# EAGLE design stk200 (EAGLE 6.2)
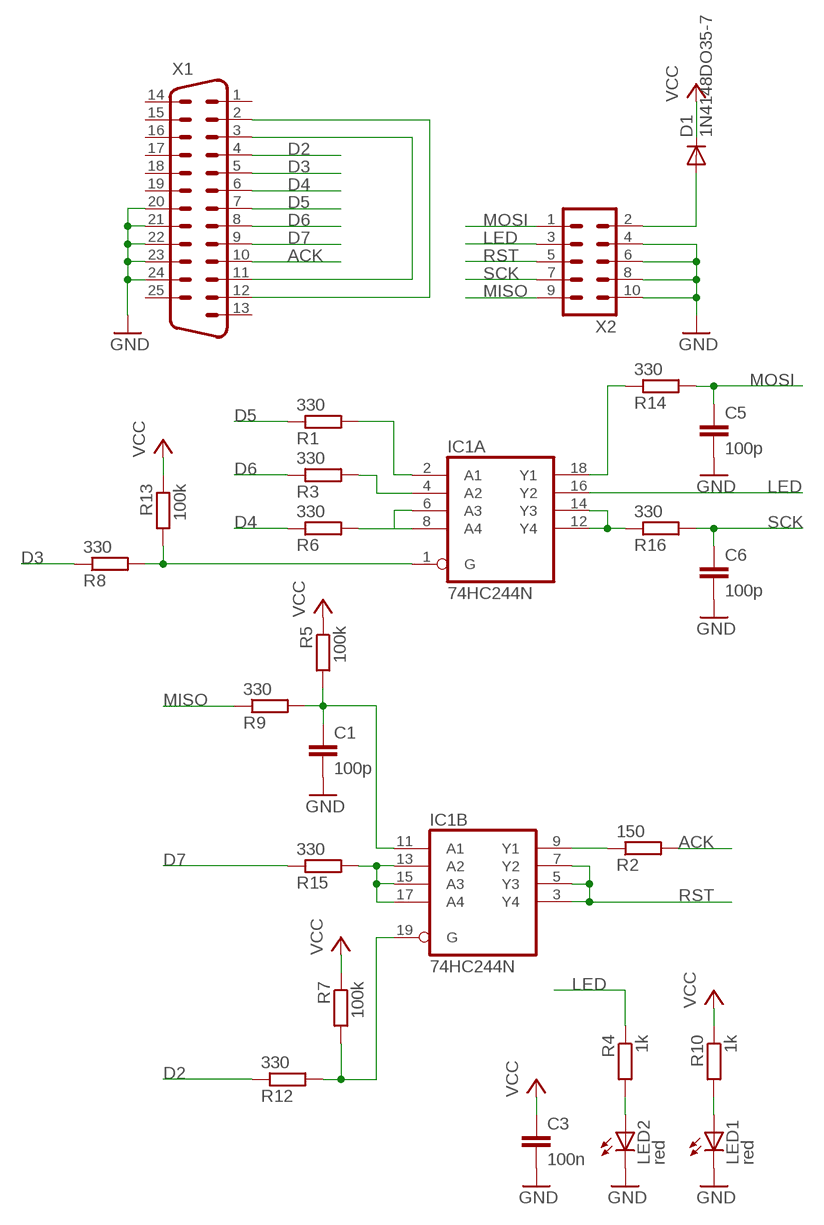
[diagram p0: schematic, sheet 1]

## Parts
C1  100p  C-EU025-024X044  [C025-024X044]
C3  100n  C-EU025-024X044  [C025-024X044]
C5  100p  C-EU102-043X133  [C102-043X133]
C6  100p  C-EU102-043X133  [C102-043X133]
D1  1N4148DO35-7  [DO35-7]
IC1  74HC244N  [DIL20]
LED1  red  LED3MM  [LED3MM]
LED2  red  LED3MM  [LED3MM]
R1  330  R-EU_0207/10  [0207/10]
R2  150  R-EU_0207/15  [0207/15]
R3  330  R-EU_0204/2V  [0204V]
R4  1k  R-EU_0207/15  [0207/15]
R5  100k  R-EU_0617/22  [0617/22]
R6  330  R-EU_0204/2V  [0204V]
R7  100k  R-EU_0204/2V  [0204V]
R8  330  R-EU_0617/17  [0617/17]
R9  330  R-EU_0204/5  [0204/5]
R10  1k  R-EU_0204/5  [0204/5]
R12  330  R-EU_0207/10  [0207/10]
R13  100k  R-EU_M1206  [M1206]
R14  330  R-EU_0204/2V  [0204V]
R15  330  R-EU_0207/12  [0207/12]
R16  330  R-EU_0204/5  [0204/5]
X1  M25D  [M25D]
X2  ML10L  [ML10L]

## Nets
ACK: R2.2 X1.10
D2: R12.1 X1.4
D3: R8.1 X1.5
D4: R6.1 X1.6
D5: R1.1 X1.7
D6: R3.1 X1.8
D7: R15.1 X1.9
GND: C1.2 C3.2 C5.2 C6.2 LED1.K(C) LED2.K(C) X1.20 X1.21 X1.22 X1.23 X1.24 X2.4 X2.6 X2.8 X2.10
LED: IC1.16(A:Y2) R4.1 X2.3
MISO: R9.1 X2.9
MOSI: C5.1 R14.2 X2.1
N$1: LED1.A R10.2
N$2: IC1.6(A:A3) IC1.8(A:A4) R6.2
N$3: D1.A X2.2
N$4: IC1.13(B:A2) IC1.15(B:A3) IC1.17(B:A4) R15.2
N$5: X1.2 X1.12
N$6: IC1.12(A:Y4) IC1.14(A:Y3) R16.1
N$7: IC1.18(A:Y1) R14.1
N$8: IC1.9(B:Y1) R2.1
N$9: IC1.19(B:G) R7.2 R12.2
N$10: IC1.4(A:A2) R3.2
N$11: IC1.2(A:A1) R1.2
N$12: IC1.1(A:G) R8.2 R13.2
N$13: LED2.A R4.2
N$15: C1.1 IC1.11(B:A1) R5.2 R9.2
N$16: X1.3 X1.11
RST: IC1.3(B:Y4) IC1.5(B:Y3) IC1.7(B:Y2) X2.5
SCK: C6.1 R16.2 X2.7
VCC: C3.1 D1.C R5.1 R7.1 R10.1 R13.1
Unconnected: X1.1 X1.13 X1.14 X1.15 X1.16 X1.17 X1.18 X1.19 X1.25

## Power pins joined to a net without a drawn wire
GND: IC1.10(P:GND)
VCC: IC1.20(P:VCC)

## Library data of the parts
C1 C3 C5 C6 = rcl:C-EU: CAPACITOR, European symbol
D1 = diode:1N4148: DIODE high speed (Philips)
IC1 = 74xx-eu:74*244: Octal BUFFER and LINE DRIVER, 3-state
LED1 LED2 = led:LED: LED OSRAM: - CHIPLED LG R971, LG N971, LY N971, LG Q971, LY Q971, LO R971, LY R971 LH N974, LH R974 LS Q976, LO Q976, LY Q976 LO Q996 - Hyper CHIPLED LW Q18S LB Q993, LB Q99A, LB R99A - SideLED LS A670, LO A670, LY A670, LG A670, LP A670 LB A673, LV A673, LT A673, LW A673 LH A674 LY A675 LS A676, LA A676, LO A676, LY A676, LW A676 LS A679, LY A679, LG A679 - Hyper Micro SIDELED® LS Y876, LA Y876, LO Y876, LY Y876 LT Y87S - SmartLED LW L88C, LW L88S LB L89C, LB L89S, LG L890 LS L89K, LO L89K, LY L89K LS L896, LA L896, LO L896, LY L896 - TOPLED LS T670, LO T670, LY T670, LG T670, LP T670 LSG T670, LSP T670, LSY T670, LOP T670, LYG T670 LG T671, LOG T671, LSG T671 LB T673, LV T673, LT T673, LW T673 LH T674 LS T676, LA T676, LO T676, LY T676, LB T676, LH T676, LSB T676, LW T676 LB T67C, LV T67C, LT T67C, LS T67K, LO T67K, LY T67K, LW E67C LS E67B, LA E67B, LO E67B, LY E67B, LB E67C, LV E67C, LT E67C LW T67C LS T679, LY T679, LG T679 LS T770, LO T770, LY T770, LG T770, LP T770 LB T773, LV T773, LT T773, LW T773 LH T774 LS E675, LA E675, LY E675, LS T675 LS T776, LA T776, LO T776, LY T776, LB T776 LHGB T686 LT T68C, LB T68C - Hyper Mini TOPLED® LB M676 - Mini TOPLED Santana® LG M470 LS M47K, LO M47K, LY M47K Source: http://www.osram.convergy.de LUXEON: - LUMILED® LXK2-PW12-R00, LXK2-PW12-S00, LXK2-PW14-U00, LXK2-PW14-V00 LXK2-PM12-R00, LXK2-PM12-S00, LXK2-PM14-U00 LXK2-PE12-Q00, LXK2-PE12-R00, LXK2-PE12-S00, LXK2-PE14-T00, LXK2-PE14-U00 LXK2-PB12-K00, LXK2-PB12-L00, LXK2-PB12-M00, LXK2-PB14-N00, LXK2-PB14-P00, LXK2-PB14-Q00 LXK2-PR12-L00, LXK2-PR12-M00, LXK2-PR14-Q00, LXK2-PR14-R00 LXK2-PD12-Q00, LXK2-PD12-R00, LXK2-PD12-S00 LXK2-PH12-R00, LXK2-PH12-S00 LXK2-PL12-P00, LXK2-PL12-Q00, LXK2-PL12-R00 Source: www.luxeon.com KINGBRIGHT: KA-3528ASYC Source: www.kingbright.com
R1-R10 R12-R16 = rcl:R-EU_: RESISTOR, European symbol
X1 = con-subd:M25: SUB-D
X2 = con-harting-ml:ML10: HARTING

## Board
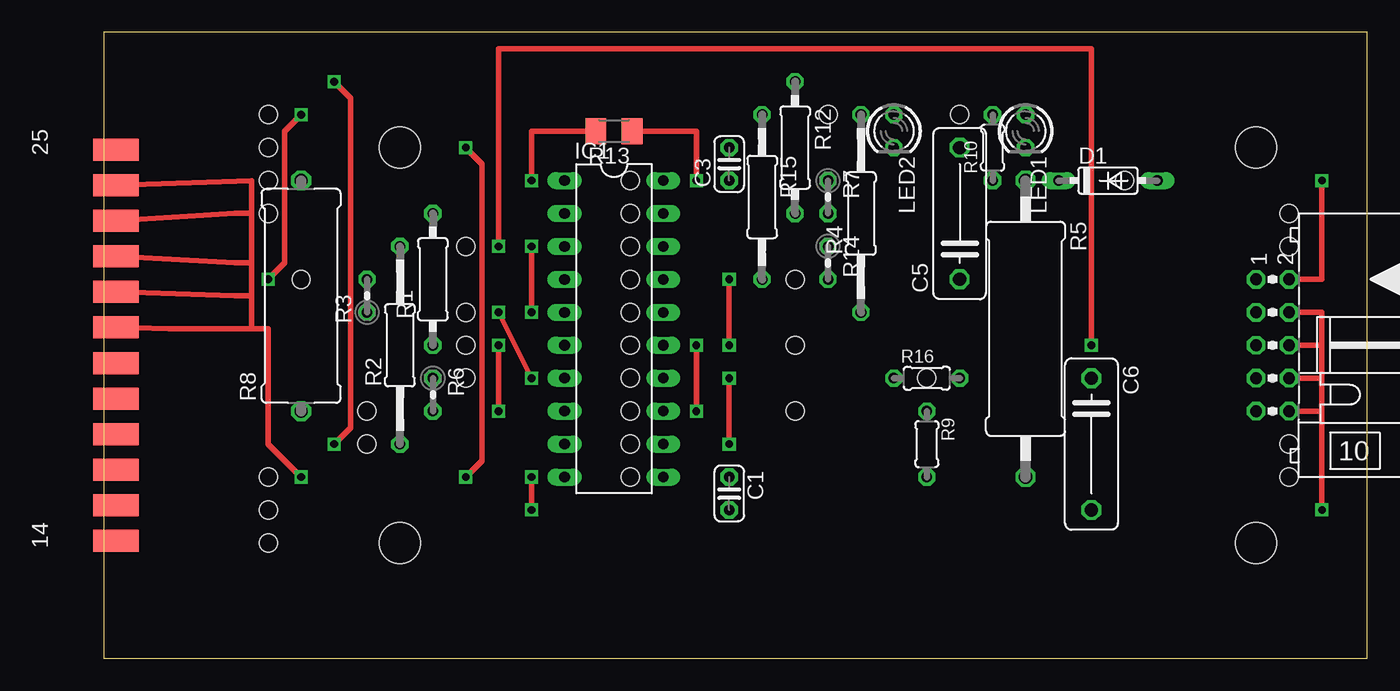
[diagram p1: board, top side]
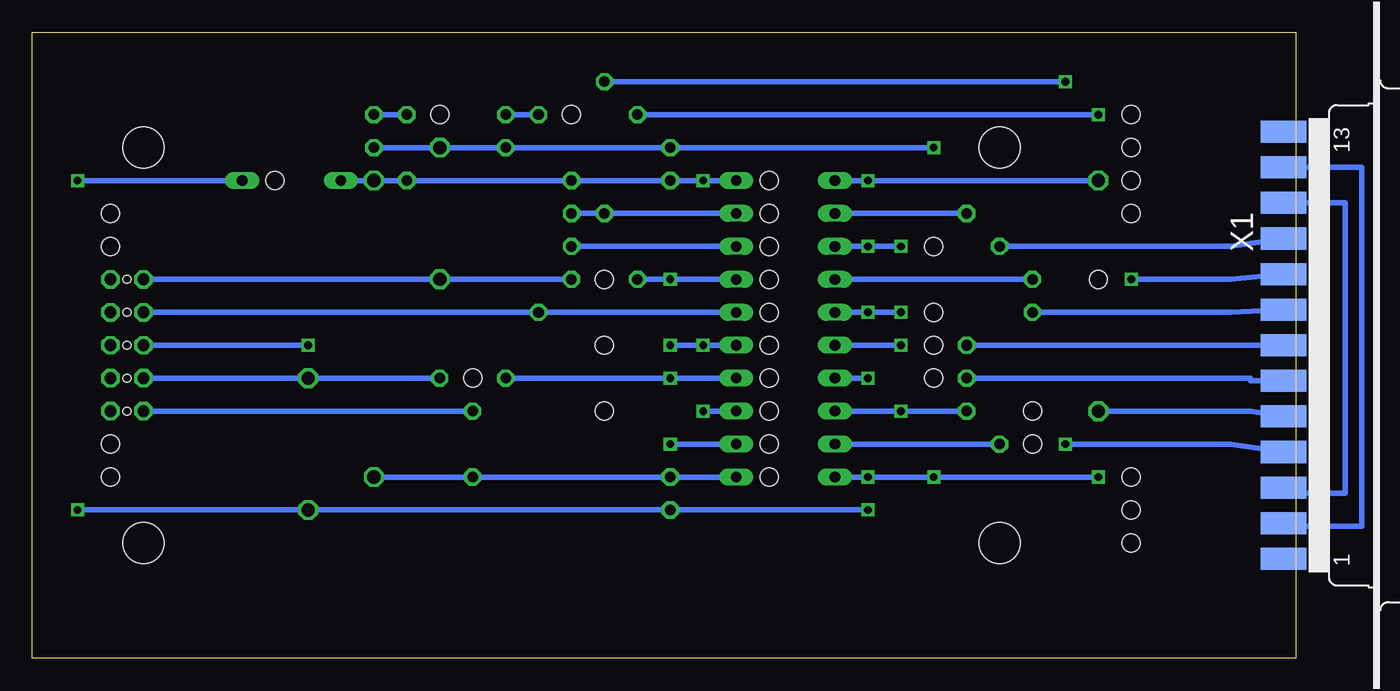
[diagram p2: board, bottom side, seen from below]

Size 97.46 x 48.25 mm. Coordinates in mm from the lower left corner, seen from the top.
Outline: 0,0 97.46,0 97.46,48.25 0,48.25 0,0
Copper layers (1*16): Top 0.035mm / dielectric 1.5mm / Bottom 0.035mm
Design rules: minimum track width 10mil, minimum drill 24mil, track to track 8mil, track to pad 8mil, pad to pad 8mil, via to via 8mil, smd to smd 8mil, copper to edge 40mil, drill to drill 8mil, minimum pad ring 10mil, minimum via ring 8mil, stop-mask expansion 4mil, vias tented up to drill 0mil, thermal gap 10mil
Holes 1.4 mm at 27.94,26.67 40.64,36.83 40.64,34.29 40.64,31.75 40.64,29.21 40.64,26.67 40.64,24.13 40.64,21.59 40.64,19.05 40.64,16.51 40.64,13.97 12.7,8.89 12.7,11.43 12.7,13.97 15.24,29.21 27.94,31.75 12.7,41.91 12.7,39.37 12.7,36.83 12.7,34.29 20.32,16.51 20.32,19.05 27.94,24.13 27.94,21.59 63.5,21.59 53.34,29.21 53.34,24.13 53.34,19.05 78.74,36.83 55.88,41.91 66.04,41.91 91.44,16.51 91.44,13.97 91.44,31.75 91.44,34.29
Holes 0.6 mm at 90.17,26.67 90.17,24.13 90.17,29.21 90.17,21.59 90.17,19.05
Holes 3.17 mm at 22.86,39.37 22.86,8.89 88.9,39.37 88.9,8.89

### Footprints (pad centres in the part's own frame; a part is rotated, then mirrored left to right if it is on the bottom)
C025-024X044 = drill 0.813 octagon: 1 -1.27,0; 2 1.27,0
C102-043X133 = drill 1.016 octagon: 1 -5.08,0; 2 5.08,0
DO35-7 = drill 0.813 long: A 3.81,0; C -3.81,0
DIL20 = drill 0.813 long: 1 -11.43,-3.81; 2 -8.89,-3.81; 3 -6.35,-3.81; 4 -3.81,-3.81; 5 -1.27,-3.81; 6 1.27,-3.81; 7 3.81,-3.81; 8 6.35,-3.81; 9 8.89,-3.81; 10 11.43,-3.81; 11 11.43,3.81; 12 8.89,3.81; 13 6.35,3.81; 14 3.81,3.81; 15 1.27,3.81; 16 -1.27,3.81; 17 -3.81,3.81; 18 -6.35,3.81; 19 -8.89,3.81; 20 -11.43,3.81
LED3MM = drill 0.813 octagon: A -1.27,0; K 1.27,0
0207/10 = drill 0.813 octagon: 1 -5.08,0; 2 5.08,0
0207/15 = drill 0.813 octagon: 1 -7.62,0; 2 7.62,0
0204V = drill 0.813 octagon: 1 -1.27,0; 2 1.27,0
0617/22 = drill 1.016 octagon: 1 -11.43,0; 2 11.43,0
0617/17 = drill 1.016 octagon: 1 -8.89,0; 2 8.89,0
0204/5 = drill 0.813 octagon: 1 -2.54,0; 2 2.54,0
M1206 = smd 1.6 x 2: 1 -1.4,0; 2 1.4,0
0207/12 = drill 0.813 octagon: 1 -6.35,0; 2 6.35,0
M25D = smd 1.7 x 3.5: 1 16.459,-6.045; 2 13.716,-6.045; 3 10.973,-6.045; 4 8.23,-6.045; 5 5.486,-6.045; 6 2.743,-6.045; 7 0,-6.045; 8 -2.743,-6.045; 9 -5.486,-6.045; 10 -8.23,-6.045; 11 -10.973,-6.045; 12 -13.716,-6.045; 13 -16.459,-6.045 | smd 1.7 x 3.5 bottom: 14 15.088,-6.045; 15 12.344,-6.045; 16 9.601,-6.045; 17 6.858,-6.045; 18 4.115,-6.045; 19 1.372,-6.045; 20 -1.372,-6.045; 21 -4.115,-6.045; 22 -6.858,-6.045; 23 -9.601,-6.045; 24 -12.344,-6.045; 25 -15.088,-6.045
ML10L = drill 0.914 octagon: 1 -5.08,-1.27; 2 -5.08,1.27; 3 -2.54,-1.27; 4 -2.54,1.27; 5 0,-1.27; 6 0,1.27; 7 2.54,-1.27; 8 2.54,1.27; 9 5.08,-1.27; 10 5.08,1.27

### Placement (x,y rotation side)
C1  48.26,12.7 270 top
C3  48.26,38.1 90 top
C5  66.04,34.29 90 top
C6  76.2,16.51 270 top
D1  77.47,36.83 0 top
IC1  39.37,25.4 270 top
LED1  71.12,40.64 270 top
LED2  60.96,40.64 270 top
R1  25.4,29.21 90 top
R2  22.86,24.13 90 top
R3  20.32,27.94 90 top
R4  58.42,34.29 90 top
R5  71.12,25.4 270 top
R6  25.4,20.32 270 top
R7  55.88,35.56 270 top
R8  15.24,27.94 90 top
R9  63.5,16.51 270 top
R10  68.58,39.37 90 top
R12  53.34,39.37 270 top
R13  39.37,40.64 180 top
R14  55.88,30.48 270 top
R15  50.8,35.56 270 top
R16  63.5,21.59 0 top
X1  -5.08,24.13 270 bottom
X2  90.17,24.13 270 top

### Tracks (layer width: path | path; a pad name or v marks a point on that pad's centre or on a via)
ACK
  Bottom 0.406: R2.2 5.08,31.75 X1.10 | X1.10 | X1.10
D2  (via drill 0.6)
  Top 0.406: v17.78,16.51 19.05,17.78 19.05,43.18 v17.78,44.45
  Bottom 0.406: v17.78,44.45 R12.1 | v17.78,16.51 5.08,16.51 X1.4 | X1.4 | X1.4
D3
  Bottom 0.406: X1.5 2.54,19.05 | X1.5 | R8.1 3.5,19.05 X1.5
D4
  Bottom 0.406: R6.1 3.5,21.59 3.5,21.39 X1.6
D5
  Bottom 0.406: X1.7 R1.1
D6
  Bottom 0.406: R3.1 5.08,26.67 X1.8 | X1.8 | X1.8
D7  (via drill 0.6)
  Top 0.406: v12.7,29.21 13.97,30.48 13.97,40.64 v15.24,41.91
  Bottom 0.406: v15.24,41.91 R15.1 | v12.7,29.21 5.08,29.21 X1.9 | X1.9 | X1.9
GND  (via drill 0.6)
  Top 0.406: X2.4 93.98,26.67 93.98,24.13 | 93.98,21.59 93.98,24.13 | 93.98,19.05 93.98,21.59 | 93.98,19.05 X2.10 | 93.98,21.59 X2.8 | 93.98,24.13 X2.6 | v15.24,13.97 12.7,16.51 12.7,25.4 11.43,25.4 | 11.43,34.29 11.43,36.83 X1.24 | 11.43,34.29 10.16,34.29 X1.23 | 11.43,30.48 11.43,34.29 | 11.43,30.48 10.16,30.48 X1.22 | 11.43,27.94 11.43,30.48 | 11.43,27.94 10.16,27.94 X1.21 | 11.43,25.4 5.08,25.4 X1.20 | 11.43,25.4 11.43,27.94 | v33.02,13.97 v33.02,11.43 | v27.94,13.97 29.21,15.24 29.21,38.1 v27.94,39.37 | v93.98,11.43 93.98,19.05
  Bottom 0.406: v33.02,11.43 C1.2 C6.2 v93.98,11.43 | v15.24,13.97 v27.94,13.97 v33.02,13.97 IC1.10 | v27.94,39.37 C3.2 LED2.K C5.2 LED1.K
LED
  Bottom 0.406: IC1.16 R4.1 X2.3
MISO
  Bottom 0.406: R9.1 X2.9
MOSI
  Bottom 0.406: R14.2 C5.1 X2.1
N$1
  Bottom 0.406: R10.2 LED1.A
N$2  (via drill 0.6)
  Top 0.406: v30.48,19.05 v30.48,24.13
  Bottom 0.406: R6.2 v30.48,19.05 IC1.8 | v30.48,24.13 IC1.6
N$3  (via drill 0.6)
  Top 0.406: v93.98,36.83 93.98,29.21 X2.2
  Bottom 0.406: D1.A v93.98,36.83
N$4  (via drill 0.6)
  Top 0.406: v48.26,24.13 v48.26,29.21 | v45.72,19.05 v45.72,24.13
  Bottom 0.406: IC1.17 v48.26,29.21 R15.2 | v48.26,24.13 v45.72,24.13 IC1.15 | IC1.13 v45.72,19.05
N$5
  Bottom 0.406: X1.12 -5.08,37.85 -5.08,10.16 0.96,10.16 X1.2
N$6  (via drill 0.6)
  Top 0.406: v48.26,16.51 v48.26,21.59
  Bottom 0.406: IC1.14 v48.26,21.59 R16.1 | IC1.12 v48.26,16.51
N$7
  Bottom 0.406: IC1.18 R14.1
N$8
  Bottom 0.406: R2.1 IC1.9
N$9
  Bottom 0.406: IC1.19 R12.2 R7.2
N$10
  Bottom 0.406: R3.2 IC1.4
N$11
  Bottom 0.406: R1.2 IC1.2
N$12  (via drill 0.6)
  Top 0.406: v33.02,36.83 33.02,40.64 R13.2
  Bottom 0.406: IC1.1 v33.02,36.83 R8.2
N$13
  Bottom 0.406: R4.2 LED2.A
N$15
  Bottom 0.406: IC1.11 C1.1 R9.2 R5.2
N$16
  Bottom 0.406: X1.11 -3.81,35.1 -3.81,12.7 0.96,12.7 X1.3
RST  (via drill 0.6)
  Top 0.406: v33.02,21.59 v30.48,26.67 | v30.48,31.75 30.48,46.99 76.2,46.99 v76.2,24.13 | v33.02,26.67 v33.02,31.75
  Bottom 0.406: IC1.3 v33.02,31.75 v30.48,31.75 | v30.48,26.67 v33.02,26.67 IC1.5 | v33.02,21.59 IC1.7 | v76.2,24.13 X2.5
SCK
  Bottom 0.406: X2.7 C6.1 R16.2
VCC  (via drill 0.6)
  Top 0.406: v45.72,36.83 45.72,40.64 R13.1
  Bottom 0.406: IC1.20 v45.72,36.83 C3.1 R7.1 R10.1 R5.1 D1.C